# Altium schematic sheet Hall_Latch.SchDoc
size A4; SheetNumber: 2; SheetTotal: 2
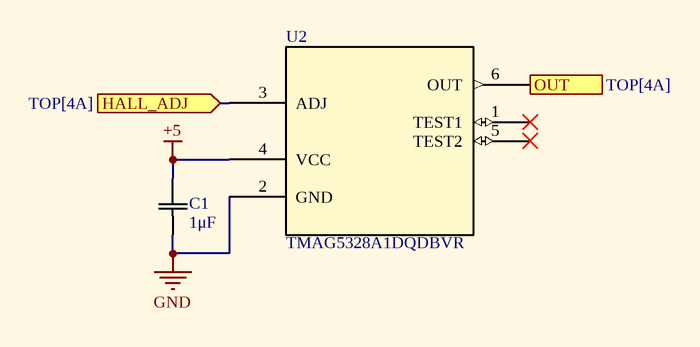
[diagram p0: Hall_Latch.SchDoc]

## Parts
C1  1μF  [CAP_CL10_SAM]
U2  TMAG5328A1DQDBVR  [SOT23_DBV_TEX]

## Ports
HALL_ADJ (in, see TOP[4A]), OUT (out, see TOP[4A])

## Nets
+5: C1.2 U2.4(VCC)
GND: C1.1 U2.2(GND)
HALL_ADJ: U2.3(ADJ) ; port HALL_ADJ
OUT: U2.6(OUT) ; port OUT

Not connected (* = marked no-connect by the designer): U2 1(TEST1)* 5(TEST2)*

## Library data of the parts
C1 = CL10B104KB8NNWC: No Description Available; Mfr_Name: Samsung; Digi-Key_Part_Number_3: 1276-1935-6-ND; Digi-Key_Part_Number_2: 1276-1935-1-ND; Digi-Key_Part_Number_1: 1276-1935-2-ND; Supplier 1: Digi-Key; Supplier Part Number 1: 1276-1935-6-ND; Supplier 2: Mouser; Supplier Part Number 2: 187-CL10B104KB8NNWC
U2 = TMAG5328A1DQDBVR: No Description Available; Mfr_Name: Texas Instruments; Copyright: Copyright (C) 2023 Ultra Librarian. All rights reserved.; Manufacturer_Part_Number: TMAG5328A1DQDBVR; RefDes: RefDes; Type: DEV; Supplier 1: Digi-Key; Supplier Part Number 1: 296-TMAG5231A1CQDBZRCT-ND